# Altium schematic sheet 05-WPT.SchDoc: Wireless Power Transfer
size A2; DocumentNumber: 5; SheetNumber: 5; SheetTotal: 15
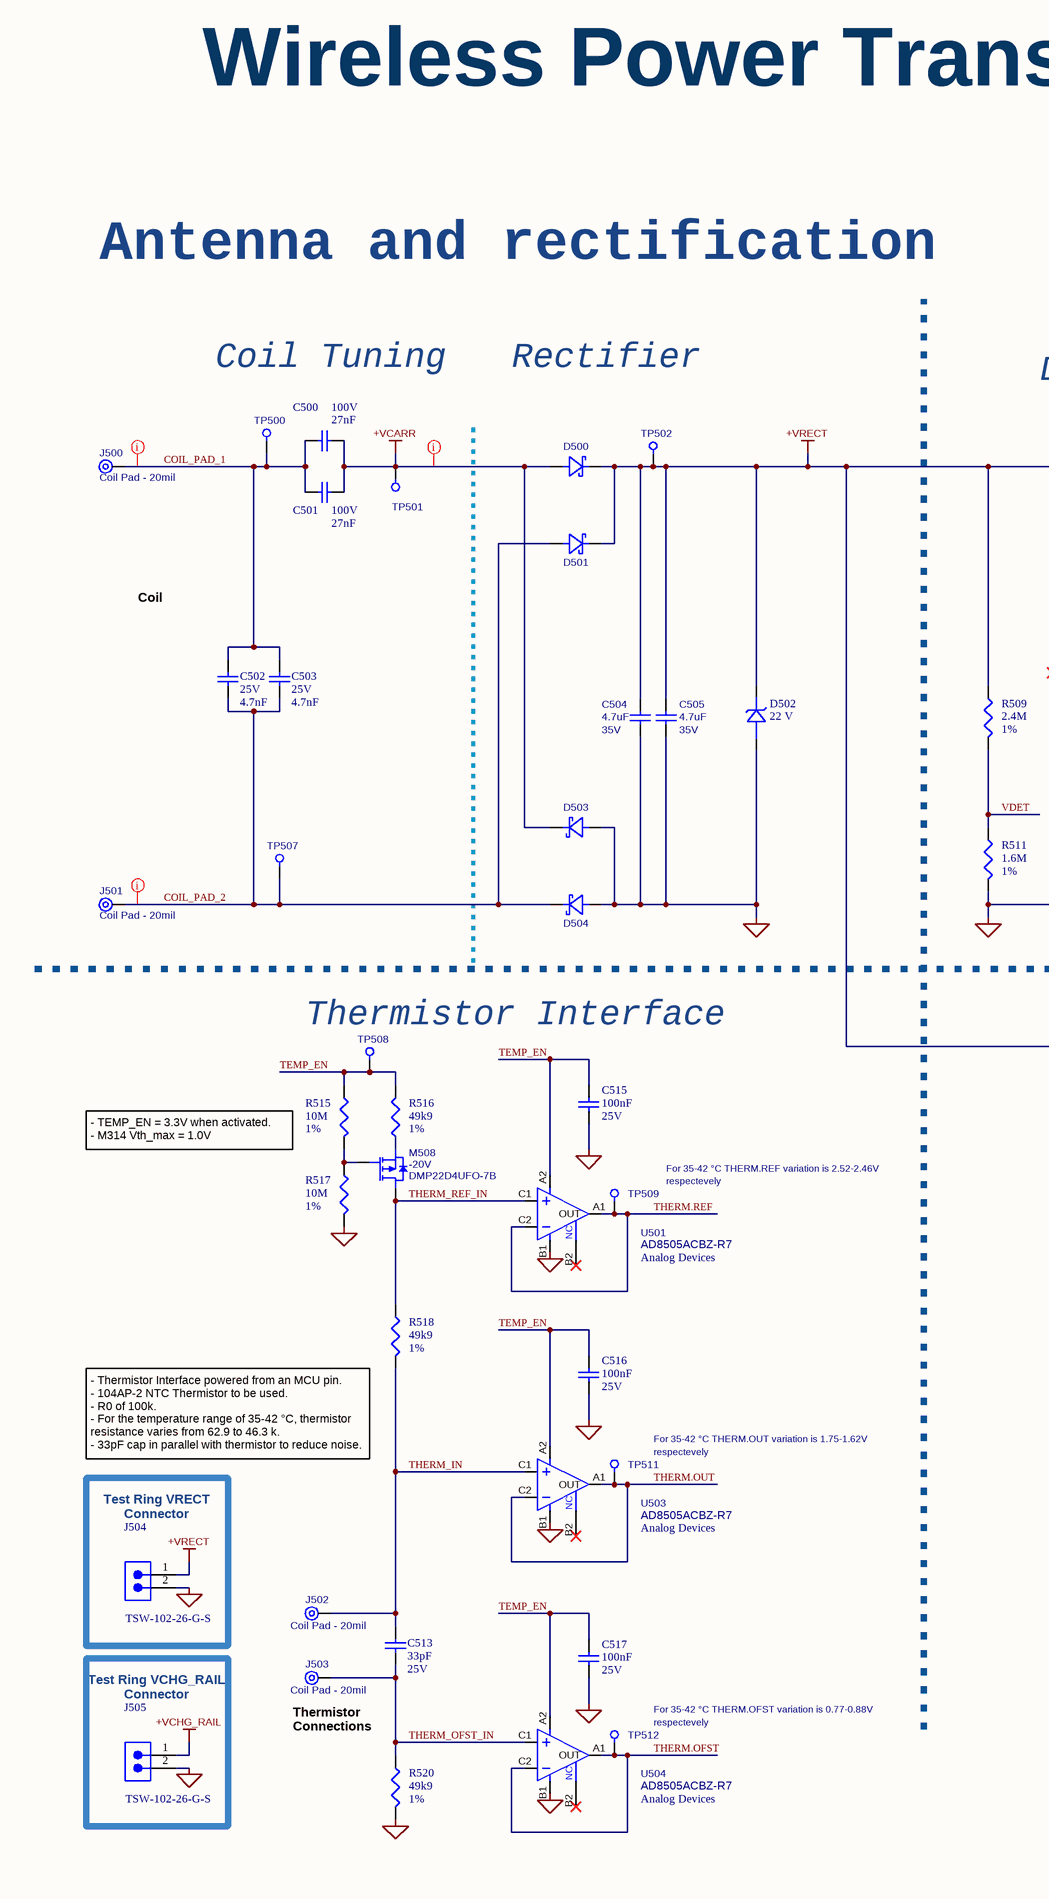
[diagram p0: 05-WPT.SchDoc, left]
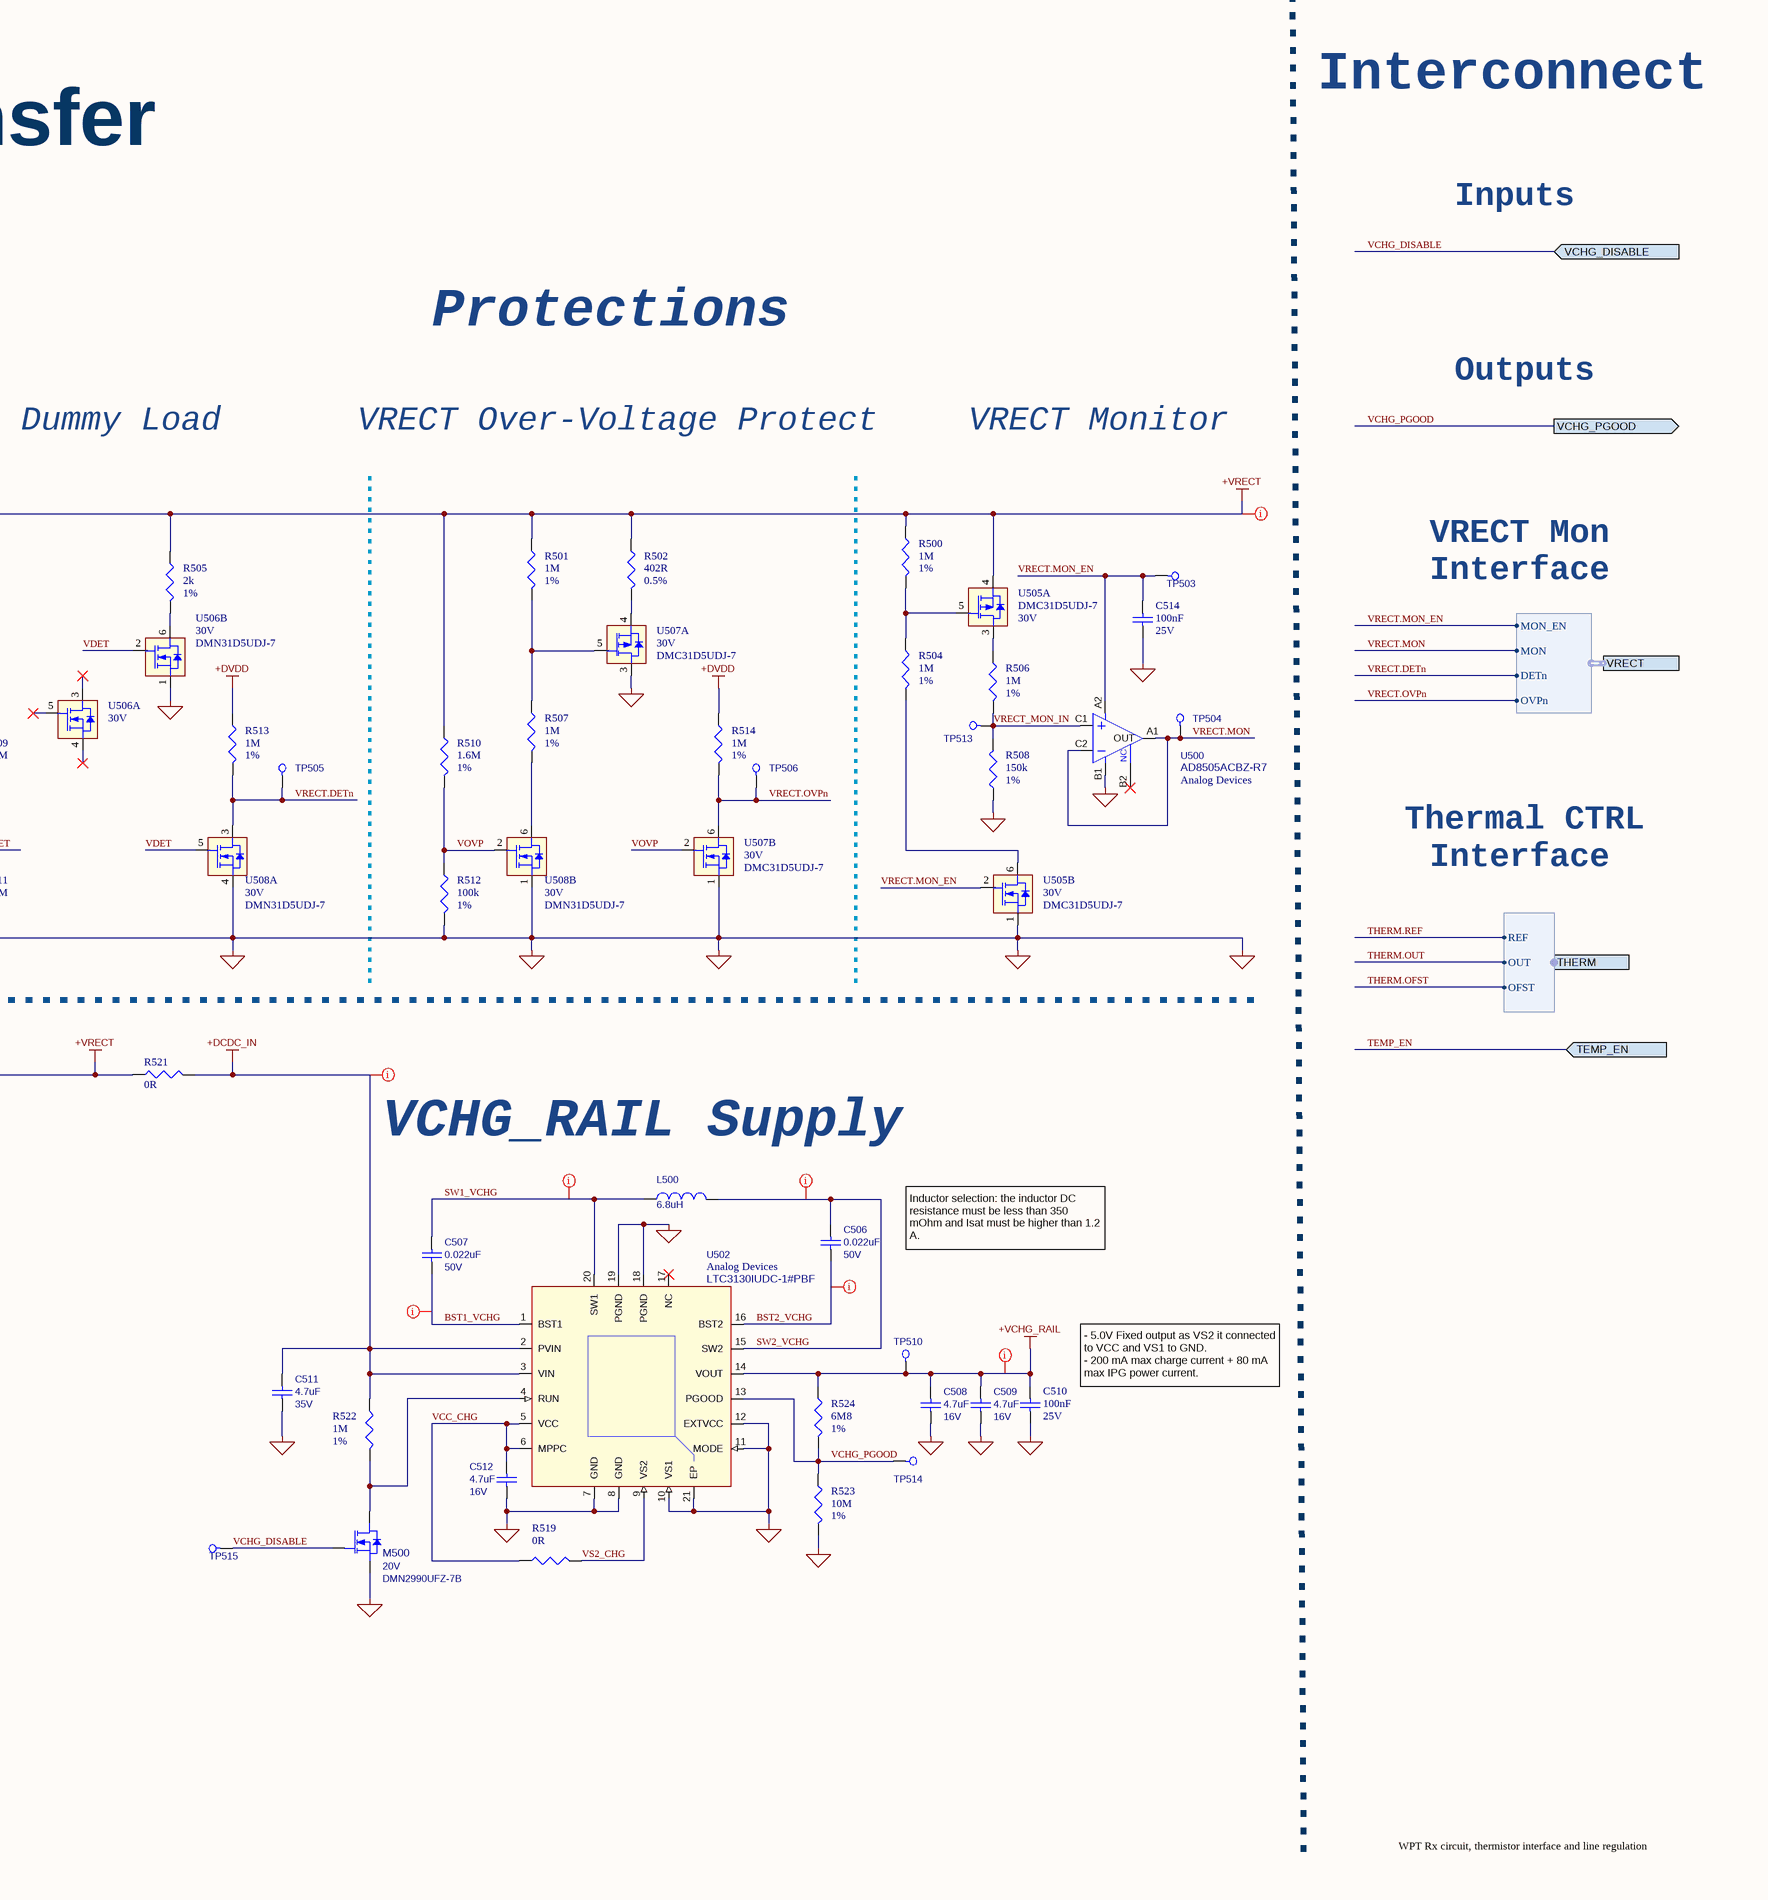
[diagram p1: 05-WPT.SchDoc, right]

## Parts
C500  value 27nF  Voltage Rating: 100V  [CAP0805_REDUCED]  (hidden comment: GRM2195C2A273GE01D)
C501  value 27nF  Voltage Rating: 100V  [CAP0805_REDUCED]  (hidden comment: GRM2195C2A273GE01D)
C502  value 4.7nF  Voltage Rating: 25V  [CAP0603_REDUCED]  (hidden comment: C0603C472F3GECTU)
C503  value 4.7nF  Voltage Rating: 25V  [CAP0603_REDUCED]  (hidden comment: C0603C472F3GECTU)
C504  value 4.7uF  Rating: 35V  [CAP0805_REDUCED]  (hidden comment: GCM21BC7YA475KE36L)
C505  value 4.7uF  Rating: 35V  [CAP0805_REDUCED]  (hidden comment: GCM21BC7YA475KE36L)
C506  value 0.022uF  Rating: 50V  [CAP0402_REDUCED]  (hidden comment: GCM155R71H223KA55D)
C507  value 0.022uF  Rating: 50V  [CAP0402_REDUCED]  (hidden comment: GCM155R71H223KA55D)
C508  value 4.7uF  Rating: 16V  [CAP0603_REDUCED]  (hidden comment: GRM188R61C475KE11)
C509  value 4.7uF  Rating: 16V  [CAP0603_REDUCED]  (hidden comment: GRM188R61C475KE11)
C510  value 100nF  Rated DC Voltage (URdc): 25V  [C0201_C]  (hidden comment: GRM033R61E104KE14J)
C511  value 4.7uF  Rating: 35V  [CAP0805_REDUCED]  (hidden comment: GCM21BC7YA475KE36L)
C512  value 4.7uF  Rating: 16V  [CAP0603_REDUCED]  (hidden comment: GRM188R61C475KE11)
C513  value 33pF  Rated DC Voltage (URdc): 25V  [C0201_C]  (hidden comment: GRM0335C1E330JA01D)
C514  value 100nF  Rated DC Voltage (URdc): 25V  [C0201_C]  (hidden comment: GRM033R61E104KE14J)
C515  value 100nF  Rated DC Voltage (URdc): 25V  [C0201_C]  (hidden comment: GRM033R61E104KE14J)
C516  value 100nF  Rated DC Voltage (URdc): 25V  [C0201_C]  (hidden comment: GRM033R61E104KE14J)
C517  value 100nF  Rated DC Voltage (URdc): 25V  [C0201_C]  (hidden comment: GRM033R61E104KE14J)
D500  GSBT0540X  [STM_SOD-523_R]  (value not drawn)
D501  GSBT0540X  [STM_SOD-523_R]  (value not drawn)
D502  Breakdown Voltage: 22 V  [SODFL1608X70N]  (hidden comment: MM5Z22VT5G)
D503  GSBT0540X  [STM_SOD-523_R]  (value not drawn)
D504  GSBT0540X  [STM_SOD-523_R]  (value not drawn)
J500  Coil Pad - 20mil  [FEEDHOLE_20mil]  (no BOM)
J501  Coil Pad - 20mil  [FEEDHOLE_20mil]  (no BOM)
J502  Coil Pad - 20mil  [FEEDHOLE_20mil]  (no BOM)
J503  Coil Pad - 20mil  [FEEDHOLE_20mil]  (no BOM)
J504  TSW-102-26-G-S  [SMTC-TSW-102-26-XX-S]
J505  TSW-102-26-G-S  [SMTC-TSW-102-26-XX-S]
L500  value 6.8uH  [LSEUC2520KKT6R8M]  (hidden comment: LSEUC2520KKT6R8M)
M500  DMN2990UFZ-7B  Rating: 20V  [DIODESINC_X2-DFN0606-3]
M508  Rating: -20V  [DIODESINC_X2-DFN0604-3]  (hidden comment: DMP22D4UFO-7B)
R500  value 1M  Tolerance: 1%  [R0201_C]  (hidden comment: CRCW02011M00FNED)
R501  value 1M  Tolerance: 1%  [R0201_C]  (hidden comment: CRCW02011M00FNED)
R502  value 402R  Tolerance: 0.5%  [R0603]  (hidden comment: SDR03EZPD4020)
R504  value 1M  Tolerance: 1%  [R0201_C]  (hidden comment: CRCW02011M00FNED)
R505  value 2k  Tolerance: 1%  [R0201_C]  (hidden comment: CRCW02012K00FNED)
R506  value 1M  Tolerance: 1%  [R0201_C]  (hidden comment: CRCW02011M00FNED)
R507  value 1M  Tolerance: 1%  [R0201_C]  (hidden comment: CRCW02011M00FNED)
R508  value 150k  Tolerance: 1%  [R0201_C]  (hidden comment: CRCW0201150KFKED)
R509  value 2.4M  Tolerance: 1%  [R0201_C]  (hidden comment: CRCW02012M40FNED)
R510  value 1.6M  Tolerance: 1%  [R0201_C]  (hidden comment: CRCW02011M60FNED)
R511  value 1.6M  Tolerance: 1%  [R0201_C]  (hidden comment: CRCW02011M60FNED)
R512  value 100k  Tolerance: 1%  [R0201_C]  (hidden comment: CRCW0201100KFNED)
R513  value 1M  Tolerance: 1%  [R0201_C]  (hidden comment: CRCW02011M00FNED)
R514  value 1M  Tolerance: 1%  [R0201_C]  (hidden comment: CRCW02011M00FNED)
R515  value 10M  Tolerance: 1%  [R0201_C]  (hidden comment: CRCW020110M0FNED)
R516  value 49k9  Tolerance: 1%  [R0201_C]  (hidden comment: CRCW020149K9FNED)
R517  value 10M  Tolerance: 1%  [R0201_C]  (hidden comment: CRCW020110M0FNED)
R518  value 49k9  Tolerance: 1%  [R0201_C]  (hidden comment: CRCW020149K9FNED)
R519  value 0R  [R0201_C]  (hidden comment: CRCW02010000Z0ED)
R520  value 49k9  Tolerance: 1%  [R0201_C]  (hidden comment: CRCW020149K9FNED)
R521  value 0R  [R0201_C]  (hidden comment: CRCW02010000Z0ED)
R522  value 1M  Tolerance: 1%  [R0201_C]  (hidden comment: CRCW02011M00FNED)
R523  value 10M  Tolerance: 1%  [R0201_C]  (hidden comment: CRCW020110M0FNED)
R524  value 6M8  Tolerance: 1%  [R0201_C]  (hidden comment: CRCW02016M80FNED)
TP500  Test Point  [testpad_0.9mm]  (value not drawn)  (no BOM)
TP501  Test Point  [testpad_0.9mm]  (value not drawn)  (no BOM)
TP502  Test Point  [testpad_0.9mm]  (value not drawn)  (no BOM)
TP503  Test Point  [testpad_0.9mm]  (value not drawn)  (no BOM)
TP504  Test Point  [testpad_0.9mm]  (value not drawn)  (no BOM)
TP505  Test Point  [testpad_0.9mm]  (value not drawn)  (no BOM)
TP506  Test Point  [testpad_0.9mm]  (value not drawn)  (no BOM)
TP507  Test Point  [testpad_0.9mm]  (value not drawn)  (no BOM)
TP508  Test Point  [testpad_0.9mm]  (value not drawn)  (no BOM)
TP509  Test Point  [testpad_0.9mm]  (value not drawn)  (no BOM)
TP510  Test Point  [testpad_0.9mm]  (value not drawn)  (no BOM)
TP511  Test Point  [testpad_0.9mm]  (value not drawn)  (no BOM)
TP512  Test Point  [testpad_0.9mm]  (value not drawn)  (no BOM)
TP513  Test Point  [testpad_0.9mm]  (value not drawn)  (no BOM)
TP514  Test Point  [testpad_0.9mm]  (value not drawn)  (no BOM)
TP515  Test Point  [testpad_0.9mm]  (value not drawn)  (no BOM)
U500  Manufacturer: Analog Devices  [AD8505ACBZ-R7]  (hidden comment: AD8505ACBZ-R7)
U501  Manufacturer: Analog Devices  [AD8505ACBZ-R7]  (hidden comment: AD8505ACBZ-R7)
U502  Manufacturer: Analog Devices  [LT_UDC-20_REDUCED]  (hidden comment: LTC3130IUDC-1#PBF)
U503  Manufacturer: Analog Devices  [AD8505ACBZ-R7]  (hidden comment: AD8505ACBZ-R7)
U504  Manufacturer: Analog Devices  [AD8505ACBZ-R7]  (hidden comment: AD8505ACBZ-R7)
U505  DMC31D5UDJ-7  Vds(Max): 30V  [DIODESINC_SOT-963-6]  (parts A,B of 2)
U506  Vds(Max): 30V  [DIODESINC_SOT-963-6]  (hidden comment: DMN31D5UDJ-7)  (parts A,B of 2)
U507  DMC31D5UDJ-7  Vds(Max): 30V  [DIODESINC_SOT-963-6]  (parts A,B of 2)
U508  DMN31D5UDJ-7  Vds(Max): 30V  [DIODESINC_SOT-963-6]  (parts A,B of 2)

## Ports
TEMP_EN (in), THERM (harness THERMAL CTRL), VCHG_DISABLE (in), VCHG_PGOOD (out), VRECT (harness VRECT)

## Harnesses
THERMAL CTRL: REF, OUT, OFST
VRECT: OVPn, DETn, MON, MON_EN

## Nets
+DCDC_IN: C511.2 R521.2 R522.1 U502.2(PVIN) U502.3(VIN)
+DVDD: R513.1 R514.1
+VCARR: C500.2 C501.2 D500.2 D503.1 TP501.1
+VCHG_RAIL: C508.1 C509.1 C510.2 J505.1 R524.1 TP510.1 U502.14(VOUT)
+VRECT: C504.2 C505.2 D500.1 D501.1 D502.1(K1) J504.1 R500.1 R501.1 R502.1 R505.1 R509.1 R510.1 R521.1 TP502.1 U505.4
GND: C504.1 C505.1 C508.2 C509.2 C510.1 C511.1 C512.2 C514.1 C515.1 C516.1 C517.1 D502.2(K1) D503.2 D504.2 J504.2 J505.2 M500.2(S) R508.1 R511.2 R512.2 R517.2 R520.2 R523.2 U500.B1(V-) U501.B1(V-) U502.7(GND) U502.8(GND) U502.10(VS1) U502.11(MODE) U502.12(EXTVCC) U502.18(PGND) U502.19(PGND) U502.21(EP) U503.B1(V-) U504.B1(V-) U505.1 U506.1 U507.1 U507.3 U508.1 U508.4
BST1_VCHG: C507.1 U502.1(BST1)
BST2_VCHG: C506.1 U502.16(BST2)
COIL_PAD_1: C500.1 C501.1 C502.2 C503.2 J500.1 TP500.1
COIL_PAD_2: C502.1 C503.1 D501.2 D504.1 J501.1 TP507.1
SW1_VCHG: C507.2 L500.1 U502.20(SW1)
SW2_VCHG: C506.2 L500.2 U502.15(SW2)
TEMP_EN: C515.2 C516.2 C517.2 R515.1 R516.2 TP508.1 U501.A2(V+) U503.A2(V+) U504.A2(V+) ; port TEMP_EN
THERM.OFST: TP512.1 U504.A1(OUT) U504.C2(IN-) ; port THERM.OFST
THERM.OUT: TP511.1 U503.A1(OUT) U503.C2(IN-) ; port THERM.OUT
THERM.REF: TP509.1 U501.A1(OUT) U501.C2(IN-) ; port THERM.REF
THERM_IN: C513.2 J502.1 R518.2 U503.C1(IN+)
THERM_OFST_IN: C513.1 J503.1 R520.1 U504.C1(IN+)
THERM_REF_IN: M508.3(D) R518.1 U501.C1(IN+)
VCC_CHG: C512.1 R519.1 U502.5(VCC) U502.6(MPPC)
VCHG_DISABLE: M500.1(G) TP515.1 ; port VCHG_DISABLE
VCHG_PGOOD: R523.1 R524.2 TP514.1 U502.13(PGOOD) ; port VCHG_PGOOD
VDET: R509.2 R511.1 U506.2 U508.5
VOVP: R510.2 R512.1 U507.2 U508.2
VRECT.DETn: R513.2 TP505.1 U508.3 ; port VRECT.DETn
VRECT.MON: TP504.1 U500.A1(OUT) U500.C2(IN-) ; port VRECT.MON
VRECT.MON_EN: C514.2 TP503.1 U500.A2(V+) U505.2 ; port VRECT.MON_EN
VRECT.OVPn: R514.2 TP506.1 U507.6 ; port VRECT.OVPn
VRECT_MON_IN: R506.2 R508.2 TP513.1 U500.C1(IN+)
VS2_CHG: R519.2 U502.9(VS2)
NetM500_3: M500.3(D) R522.2 U502.4(RUN)
NetM508_1: M508.1(G) R515.2 R517.1
NetM508_2: M508.2(S) R516.1
NetR500_2: R500.2 R504.1 U505.5
NetR501_2: R501.2 R507.1 U507.5
NetR502_2: R502.2 U507.4
NetR504_2: R504.2 U505.6
NetR505_2: R505.2 U506.6
NetR506_1: R506.1 U505.3
NetR507_2: R507.2 U508.6

Not connected (* = marked no-connect by the designer): U500 B2(NC)*; U501 B2(NC)*; U502 17(NC)*; U503 B2(NC)*; U504 B2(NC)*; U506 3* 4* 5*

## Layout directives
rule Supply Nets [Voltage = 5.000]; net class POWER: +VCHG_RAIL
net class POWER; Voltage: 0-11V: +DCDC_IN, +VCARR, +VRECT, COIL_PAD_1, COIL_PAD_2
net class POWER; Voltage: 0-11V; net class DCDC_LOOP: BST1_VCHG, BST2_VCHG, SW1_VCHG, SW2_VCHG

## Notes on the sheet
- Interconnect
- Wireless Power Transfer
- Inputs
- Antenna and rectification
- Protections
- Coil Tuning
- Rectifier
- Outputs
- Dummy Load
- VRECT Over-Voltage Protect
- VRECT Monitor
- VRECT Mon
- Interface
- Coil
  Connections
- Thermal CTRL
- (near TP508) Thermistor Interface
- - TEMP_EN = 3.3V when activated.
  - M314 Vth_max = 1.0V
- VCHG_RAIL Supply
- For 35-42 °C THERM.REF variation is 2.52-2.46V
- respectevely
- Inductor selection: the inductor DC resistance must be less than 350 mOhm and Isat must be higher than 1.2 A.
- - 5.0V Fixed output as VS2 it connected to VCC and VS1 to GND.
  - 200 mA max charge current + 80 mA max IPG power current.
- (near R518) - Thermistor Interface powered from an MCU pin.
  - 104AP-2 NTC Thermistor to be used.
  - R0 of 100k.
  - For the temperature range of 35-42 °C, thermistor resistance varies from 62.9 to 46.3 k.
  - 33pF cap in parallel with thermistor to reduce noise.
- For 35-42 °C THERM.OUT variation is 1.75-1.62V
- (near J504) Test Ring VRECT
  Connector
- (near J505) Test Ring VCHG_RAIL
  Connector
- For 35-42 °C THERM.OFST variation is 0.77-0.88V
- Thermistor
  Connections
- WPT Rx circuit, thermistor interface and line regulation
- Project:
- Schematic:
- Design by:
- Date:
- Ver:
- .
- Comments:
- Reviewed by:

## Library data of the parts
C500 C501 = GRM2195C2A273GE01D: Capacitor, 27nF, C0G, 100VDC, 2%, 0805, Implant-grade; Manufacturer: Murata; Medical Grade Manufacturer: TBD; Category: Capacitor; Temperature Coefficient: -; Manufacturer Part Number: GRM2195C2A273GE01D; Medical Grade Manufacturer Part Number: TBD; Size Code: Size Code; Supplier: TBD; Supplier Part Number: 0.85mm; Height: 1.25mm; Width: 1.25mm; Length: 2mm; Tolerance: 2%; Dielectric: C0G; Supplier 1: Mouser; Supplier Part Number 1: 81-GRM2195C2A273GE1D; Supplier 2: Digikey; Supplier Part Number 2: 490-GRM2195C2A273GE01DCT-ND; Supplier 3: Digikey; Supplier Part Number 3: 490-GRM2195C2A273GE01DDKR-ND; Supplier 4: Digikey; Supplier Part Number 4: 490-GRM2195C2A273GE01DTR-ND
C502 C503 = C0603C472F3GECTU: Capacitor, 4.7nF, C0G, 25V, 1%, 0603, Implant-grade; Manufacturer: KEMET; Medical Grade Manufacturer: TBD; Category: Capacitor; Temperature Coefficient: -; Manufacturer Part Number: C0603C472F3GECTU; Medical Grade Manufacturer Part Number: TBD; Size Code: 0805; Supplier: -; Supplier Part Number: -; Height: 0.78mm; Width: 1.25mm; Length: 2mm; Tolerance: 1%; Dielectric: C0G; Supplier 1: Mouser; Supplier Part Number 1: 80-C0603C472F3GEC
C504 C505 C511 = GCM21BC7YA475KE36L: Capacitor, 4.7uF, X7S, 35V, 10%, 0805, Implant-grade; Manufacturer: Murata; Medical Grade MFR PN: GCH21BC7YA475KE11; Review: 020823; Length (mm): 2.00 ±0.20; Medical Grade MFR: Murata; PCB Footprint: cap0805_reduced; Thickness (mm): 1.25 ±0.20; Width (mm): 1.25 ±0.20; Category: Capacitor; Package Description: 0805; Check: *; Supplier 1: Arrow Electronics; Supplier Part Number 1: GCM21BC7YA475KE36L; Status: Approved; Manufacturer Part Number: GCM21BC7YA475KE36L
C506 C507 = GCM155R71H223KA55D: Capacitor, 0.022uF, X7R, 50V, 10%, 0402, Implant-grade; Manufacturer: Murata; Medical Grade MFR PN: GCH155R71H223KE01; Review: 020823; Length (mm): 1.00 ±0.05; Medical Grade MFR: Murata; PCB Footprint: cap0402_reduced; Thickness (mm): 0.50 ±0.05; Width (mm): 0.50 ±0.05; Category: Capacitor; Package Description: 0402; Check: *; Supplier 1: Arrow Electronics; Supplier Part Number 1: GCM155R71H223KA55D; Status: Approved; Manufacturer Part Number: GCM155R71H223KA55D
C508 C509 C512 = GRM188R61C475KE11: Capacitor, 4.7uF, X5R, 16V, 10%, 0603, Implant-grade; Manufacturer: Murata; Medical Grade MFR PN: GCH188R61C475KE11; Length (mm): 1.60 ±0.10; Medical Grade MFR: Murata; PCB Footprint: cap0603_reduced; Thickness (mm): 0.80 ±0.10; Width (mm): 0.80 ±0.10; Category: Capacitor; Package Description: 0603; Check: *; Supplier 1: Arrow Electronics; Supplier Part Number 1: GRM188R61C475KE11D; Status: *; Review: *; Manufacturer Part Number: GRM188R61C475KE11
C510 C514-C517 = GRM033R61E104KE14J: Ceramic Capacitor, Multilayer, Ceramic, 25V, 10% +Tol, 10% -Tol, X5R, 15% TC, 0.1uF, Surface Mount, 0201; Manufacturer: Murata; Multilayer: Yes; Supplier: Digikey; Supplier Part Number: 490-14571-1-ND; Manufacturer Part Number: GRM033R61E104KE14J; RoHS: Yes; Category: Ceramic Capacitors; Stock: 1540851; Pricing: 1=0,1, 10=0,033, 50=0,0192, 100=0,0148, 500=0,01118, 1000=0,00878, 2500=0,00798, 5000=0,00734 (USD); Mounting Technology: Surface Mount; Pins: 2; Dielectric Material: Ceramic; Package Shape: Rectangular; Case/Package: 0201; Terminal Finish: Nickel; Min Operating Temperature: -55°C; Max Operating Temperature: 85°C; JESD-609 Code: e3; Capacitor Type: Ceramic; Tolerance  (fill in as +-): 10%; Package Style: SMTMeter; Packaging: Tape and Reel; Tolerance (fill in as +-): 10%; Temperature Characteristics Code: X5R; Termination: Wraparound; Length: 0.6mm; Width: 0.3mm; Height: 0.3mm; Reach SVHC Compliant: Yes; RoHS Compliant: Yes; ComponentLink1URL: https://psearch.en.murata.com:443/capacitor/product/GRM033R61E104KE14%23.pdf?src-supplier=IHS+Markit; ComponentLink1Description: https://psearch.en.murata.com:443/capacitor/product/GRM033R61E104KE14%23.pdf?src-supplier=IHS+Markit; ComponentLink2URL: http://www.mouser.com/ds/2/281/c02e-2905.pdf?src-supplier=Mouser; ComponentLink2Description: http://www.mouser.com/ds/2/281/c02e-2905.pdf?src-supplier=Mouser; ComponentLink3URL: http://search.murata.co.jp/Ceramy/image/img/A01X/G101/ENG/GRM033R61E104KE14-01.pdf?src-supplier=Digikey; ComponentLink3Description: http://search.murata.co.jp/Ceramy/image/img/A01X/G101/ENG/GRM033R61E104KE14-01.pdf?src-supplier=Digikey; ComponentLink4URL: https://search.murata.co.jp/Ceramy/image/img/A01X/G101/ENG/GRM033R61E104KE14-01.pdf?src-supplier=Digikey; ComponentLink4Description: https://search.murata.co.jp/Ceramy/image/img/A01X/G101/ENG/GRM033R61E104KE14-01.pdf?src-supplier=Digikey; Supplier 1: Arrow Electronics; Supplier Part Number 1: GRM033R61E104KE14J
C513 = GRM0335C1E330JA01D: Ceramic Capacitor, Multilayer, Ceramic, 25V, 5% +Tol, 5% -Tol, C0G, 30ppm/Cel TC, 0.000033uF, Surface Mount, 0201; Manufacturer: Murata; Multilayer: Yes; Supplier: Digikey; Supplier Part Number: 490-10678-1-ND; Manufacturer Part Number: GRM0335C1E330JA01D; RoHS: Yes; Category: Ceramic Capacitors; Stock: 355128; Pricing: 1=0,1, 10=0,011, 50=0,0062, 100=0,0048, 500=0,0036, 1000=0,00283, 2500=0,00258, 5000=0,00237 (USD); Mounting Technology: Surface Mount; Pins: 2; Dielectric Material: Ceramic; Package Shape: Rectangular; Case/Package: 0201; Terminal Finish: Nickel; Min Operating Temperature: -55°C; Max Operating Temperature: 125°C; JESD-609 Code: e3; Capacitor Type: Ceramic; Tolerance  (fill in as +-): 5%; Package Style: SMTMeter; Packaging: Tape and Reel; Tolerance (fill in as +-): 5%; Temperature Characteristics Code: C0G; Termination: Wraparound; Length: 0.6mm; Width: 0.3mm; Height: 0.3mm; Reach SVHC Compliant: Yes; RoHS Compliant: Yes; ComponentLink1URL: https://datasheet.ciiva.com:443/pdfs/VipMasterIC/IC/MURE/MURE-S-A0004347008/MURE-S-A0004347461-1.pdf?src-supplier=IHS+Markit; ComponentLink1Description: https://datasheet.ciiva.com:443/pdfs/VipMasterIC/IC/MURE/MURE-S-A0004347008/MURE-S-A0004347461-1.pdf?src-supplier=IHS+Markit; ComponentLink2URL: https://datasheet.ciiva.com/29538/partnumbering-e-01-29538933.pdf?src-supplier=Digikey; ComponentLink2Description: https://datasheet.ciiva.com/29538/partnumbering-e-01-29538933.pdf?src-supplier=Digikey; Supplier 1: Arrow Electronics; Supplier Part Number 1: GRM0335C1E330JA01D
D500 D501 D503 D504 = GSBT0540X: DIODE SCHOTTKY 40V 500MA SOD523; Manufacturer: Good-Ark Semiconductor; Medical Grade MFR: TBD; Rating: 40V, 500mA; Medical Grade MFR PN: TBD; PCB Footprint: TBD; Category: Diode; Package Description: SOD-523; Supplier 1: Digikey; Supplier Part Number 1: 4786-GSBT0540XCT-ND; Manufacturer Part Number: GSBT0540X
D502 = MM5Z22VT5G: ZEN SOD523 LOW IZ REG 0.5W 22V; Manufacturer: onsemi; Type: Zener; Number of Channels: 1; Forward Voltage: 900 mV @ 10 mA; Power Dissipation: 500 mW; Category: Diode; Manufacturer Part Number: MM5Z22VT5G; Supplier 1: Digikey; Supplier Part Number 1: MM5Z2V4T1GOSCT-ND; Mounting Type: SMD; Height: 0.6 mm; Working Voltage: *; Clamping Voltage: *; Peak Pulse Current: *; Diode Capacitance: *
J500-J503 = Coil Pad - 20mil: Coil TH pad, 20mil; PCB Footprint: TBD; Value: Coil Solder Pad; Category: Coil Solder Pad; Length (mm): TBD; Manufacturer: N/A; Manufacturer PN: N/A; Medical Grade MFR: N/A; Medical Grade MFR PN: N/A; Rating: N/A; Thickness (mm): N/A; Width (mm): TBD; Package Description: N/A; Status: *; Review: *
J504 J505 = TSW-102-26-G-S: Conn Unshrouded Header HDR 2 POS 2.54mm Solder ST Thru-Hole; Manufacturer: Samtec; Number of Contacts: 2; Gender: Male; Max Current Rating: 7.6A; Max Voltage Rating (AC): 550V; RoHS: True; ComponentLink1Description: Manufacturer URL; DatasheetVersion: F-214; Orientation: Vertical; Pitch: 2.54 mm; ComponentLink1URL: http://www.samtec.com; ComponentLink3Description: Package Specification; ComponentLink2Description: Datasheet; PackageVersion: DM, 8/1988; PackageDescription: .025[0.64] SQ. Post Terminal Strip Assembly; PackageReference: TSW-102-26-XX-S; Mounting Technology: Through-hole; Temperature Range: -55 to 125 degC; ComponentLink3URL: http://www.samtec.com/documents/webfiles/cpdf/TSW-XXX-XX-XXX-X-XX-XXX-MKT.pdf; ComponentLink2URL: http://www.samtec.com/documents/webfiles/pdf/TSW_TH.PDF; PartNumber: TSW-102-26-G-S; Supplier: Newark; Supplier Part Number: 12P1301; Manufacturer Part Number: TSW-102-26-G-S; Category: Connectors; Stock: 3117; Pricing: 1=0.51000, 10=0.47500, 100=0.33200, 500=0.28400, 1000=0.23700, 2500=0.21000, 5000=0.20400 (USD); Contact Material: Bronze; Contact Finish - Mating: GOLD; Insulation Color: Black; Insulation Material: PBT; Connector Type: Header; Termination: Solder; Flammability Rating: UL94 V-0; Reach SVHC Compliant: Yes; RoHS Compliant: Yes; ComponentLink4URL: https://datasheet.ciiva.com/10281/htsw-th-10281416.pdf?src-supplier=Avnet; ComponentLink4Description: https://datasheet.ciiva.com/10281/htsw-th-10281416.pdf?src-supplier=Avnet; ComponentLink5URL: https://datasheet.ciiva.com/6887/tsw-xxx-xx-xxx-x-xx-xxx-mkt-6887237.pdf?src-supplier=Digi-Key; ComponentLink5Description: https://datasheet.ciiva.com/6887/tsw-xxx-xx-xxx-x-xx-xxx-mkt-6887237.pdf?src-supplier=Digi-Key; Supplier 1: Digikey; Supplier Part Number 1: SAM1077-02-ND; Contact Plating: Gold; Color: Black; Housing Material: Polyester; Contact Shape: Square; Housing Color: Black; Min Operating Temperature: -55°C; Max Operating Temperature: 125°C; Number of Rows: 1; Packaging: Bulk; Number of Positions: 2; Series: TSW; Contact Type: Male Pin; Fastening Type: Pull; Package Quantity: 1; Length: 5.08mm; Width: 2.54mm; Contact Mating Length: 0.23inch; Depth: 2.54mm; Radiation Hardening: No; Lead Free: Lead Free
L500 = LSEUC2520KKT6R8M: 6.8 µH Unshielded Wirewound Inductor 1.3 A 265mOhm Max 1008 (2520 Metric); Manufacturer: Taiyo Yuden; Medical Grade MFR: TBD; Rating: 1.3A; Length (mm): 2.50 ±0.20; Medical Grade MFR PN: TBD; PCB Footprint: TBD; Thickness (mm): 1.00; Width (mm): 2.00 ±0.20; Category: Inductor; Supplier 1: DigiKey; Supplier Part Number 1: 587-LSEUC2520KKT6R8MCT-ND; Manufacturer Part Number: LSEUC2520KKT6R8M
M500 = DMN2990UFZ-7B: MOSFET, N-Chan, 20V, 170mA, DFN0606; Manufacturer: Diodes Inc; Medical Grade MFR: TBD; Review: 020823; Category: Transistor; Length (mm): 0.62 ±0.05; Medical Grade MFR PN: TBD; PCB Footprint: TBD; Thickness (mm): 0.38 ±0.02; Value: DMN2990UFZ-7B; Width (mm): 0.62 ±0.05; Supplier 1: Digi-Key; Supplier Part Number 1: DMN2990UFZ-7BDICT-ND; Status: Approved; Manufacturer Part Number: DMN2990UFZ-7B
M508 = DMP22D4UFO-7B: MOSFET, P-chan, -20V, -383mA, DFN0604; Manufacturer: Diodes Inc; Medical Grade MFR: TBD; Review: 020823; Category: Transistor; Length (mm): 0.60 ±0.05; Medical Grade MFR PN: TBD; PCB Footprint: TBD; Thickness (mm): 0.36 ±0.04; Value: DMP22D4UFO-7B; Width (mm): 0.40 ±0.05; Supplier 1: Digi-Key; Supplier Part Number 1: 31-DMP22D4UFO-7BCT-ND; Status: Approved; Manufacturer Part Number: DMP22D4UFO-7B
R500 R501 R504 R506 R507 R513 R514 R522 = CRCW02011M00FNED: Fixed Resistor, Metal Glaze/thick Film, 0.05W, 1000000ohm, 30V, 1% +/-Tol, 200ppm/Cel, Surface Mount, 0201; Manufacturer: Vishay; Medical Grade MFR: Mini-Systems; Medical Grade MFR PN: MWA96SM-1004F-NS62TR; Power: 50mW; Rated Temperature: 70°C; Temperature Coefficient: 200ppm/°C; Package Height: 0.23mm; Package Length: 0.6mm; Package Width: 0.3mm; Reference Standard: AEC-Q200; Category: Chip SMD Resistors; Supplier: Digikey; Supplier Part Number: 541-1.00MABCT-ND; Manufacturer Part Number: CRCW02011M00FNED; RoHS: Yes; Stock: 392914; Pricing: 1=0,1, 10=0,037, 50=0,0242, 100=0,0204, 500=0,01426, 1000=0,01241, 5000=0,00924 (USD); Mounting Technology: Surface Mount; Pins: 2; Package Shape: Rectangular; Case/Package: 0201; Terminal Finish: Nickel; Min Operating Temperature: -55°C; Max Operating Temperature: 155°C; JESD-609 Code: e3; Resistor Type: FIXED RESISTOR; Construction: Chip; Package Style: SMTMeter; Packaging: Tape and Reel; Technology: METAL GLAZE/THICK FILM; Termination: Wraparound; Working Voltage: 30V; Reach SVHC Compliant: Yes; RoHS Compliant: Yes; ComponentLink1URL: https://datasheet.ciiva.com:443/pdfs/VipMasterIC/IC/VISH/VISH-S-A0002932828/VISH-S-A0002932828-1.pdf?src-supplier=IHS+Markit; ComponentLink1Description: https://datasheet.ciiva.com:443/pdfs/VipMasterIC/IC/VISH/VISH-S-A0002932828/VISH-S-A0002932828-1.pdf?src-supplier=IHS+Markit; ComponentLink2URL: https://datasheet.ciiva.com/7841/1719906-7841438.pdf?src-supplier=Element14; ComponentLink2Description: https://datasheet.ciiva.com/7841/1719906-7841438.pdf?src-supplier=Element14; ComponentLink3URL: https://datasheet.ciiva.com/7841/1719906-7841439.pdf?src-supplier=Element14; ComponentLink3Description: https://datasheet.ciiva.com/7841/1719906-7841439.pdf?src-supplier=Element14; ComponentLink4URL: https://datasheet.ciiva.com/7859/dcrcwe3-7859689.pdf?src-supplier=Element14; ComponentLink4Description: https://datasheet.ciiva.com/7859/dcrcwe3-7859689.pdf?src-supplier=Element14; ComponentLink5URL: https://datasheet.ciiva.com/16757/70202042-16757675.pdf?src-supplier=Allied+Electronics; ComponentLink5Description: https://datasheet.ciiva.com/16757/70202042-16757675.pdf?src-supplier=Allied+Electronics; ComponentLink6URL: https://datasheet.ciiva.com/22692/1719906-22692761.pdf?src-supplier=Element14; ComponentLink6Description: https://datasheet.ciiva.com/22692/1719906-22692761.pdf?src-supplier=Element14; ComponentLink7URL: https://datasheet.ciiva.com/9109/crcw0201e3-9109910.pdf?src-supplier=Avnet; ComponentLink7Description: https://datasheet.ciiva.com/9109/crcw0201e3-9109910.pdf?src-supplier=Avnet; ComponentLink8URL: https://datasheet.ciiva.com/22675/1847332-22675065.pdf?src-supplier=Element14; ComponentLink8Description: https://datasheet.ciiva.com/22675/1847332-22675065.pdf?src-supplier=Element14; ComponentLink9URL: https://datasheet.ciiva.com/2474/crcw0201e3-2474824.pdf?src-supplier=Digikey; ComponentLink9Description: https://datasheet.ciiva.com/2474/crcw0201e3-2474824.pdf?src-supplier=Digikey; ComponentLink10URL: https://datasheet.ciiva.com/2474/crcw0201e3-2474825.pdf?src-supplier=Digikey; ComponentLink10Description: https://datasheet.ciiva.com/2474/crcw0201e3-2474825.pdf?src-supplier=Digikey; ComponentLink11URL: https://datasheet.ciiva.com/2474/crcw0201e3-2474826.pdf?src-supplier=Digikey; ComponentLink11Description: https://datasheet.ciiva.com/2474/crcw0201e3-2474826.pdf?src-supplier=Digikey; Supplier 1: Digikey; Supplier Part Number 1: 541-1.00MABCT-ND
R502 = SDR03EZPD4020: 402 Ohms ±0.5% 0.4W Chip Resistor 0603 (1608 Metric) Automotive AEC-Q200, Pulse Withstanding Thick Film; Manufacturer: Vishay; Power: 400mW; Category: Chip SMD Resistors; Manufacturer Part Number: SDR03EZPD4020; RoHS: Yes; Mounting Technology: Surface Mount; Pins: 2; Package Shape: Rectangular; Case/Package: 0603; Terminal Finish: Nickel; Min Operating Temperature: -55°C; Max Operating Temperature: 155°C; Construction: Chip; ComponentLink1URL: https://datasheet.ciiva.com:443/pdfs/VipMasterIC/IC/VISH/VISH-S-A0002932828/VISH-S-A0002932828-1.pdf?src-supplier=IHS+Markit; ComponentLink1Description: https://datasheet.ciiva.com:443/pdfs/VipMasterIC/IC/VISH/VISH-S-A0002932828/VISH-S-A0002932828-1.pdf?src-supplier=IHS+Markit; ComponentLink2URL: https://datasheet.ciiva.com/2471/crcw0201e3-2471712.pdf?src-supplier=Digikey; ComponentLink2Description: https://datasheet.ciiva.com/2471/crcw0201e3-2471712.pdf?src-supplier=Digikey; ComponentLink3URL: https://datasheet.ciiva.com/7841/1719906-7841431.pdf?src-supplier=Element14; ComponentLink3Description: https://datasheet.ciiva.com/7841/1719906-7841431.pdf?src-supplier=Element14; ComponentLink4URL: https://datasheet.ciiva.com/7841/1719906-7841430.pdf?src-supplier=Element14; ComponentLink4Description: https://datasheet.ciiva.com/7841/1719906-7841430.pdf?src-supplier=Element14; ComponentLink5URL: https://datasheet.ciiva.com/22665/1847332-22665688.pdf?src-supplier=Element14; ComponentLink5Description: https://datasheet.ciiva.com/22665/1847332-22665688.pdf?src-supplier=Element14; ComponentLink6URL: https://datasheet.ciiva.com/2471/crcw0201e3-2471713.pdf?src-supplier=Digikey; ComponentLink6Description: https://datasheet.ciiva.com/2471/crcw0201e3-2471713.pdf?src-supplier=Digikey; Supplier 1: DigiKey; Supplier Part Number 1: 846-SDR03EZPD4020CT-ND; ComponentLink7URL: https://datasheet.ciiva.com/2471/crcw0201e3-2471711.pdf?src-supplier=Digikey; ComponentLink7Description: https://datasheet.ciiva.com/2471/crcw0201e3-2471711.pdf?src-supplier=Digikey; ComponentLink8URL: https://datasheet.ciiva.com/16757/70202042-16757849.pdf?src-supplier=Allied+Electronics; ComponentLink8Description: https://datasheet.ciiva.com/16757/70202042-16757849.pdf?src-supplier=Allied+Electronics; ComponentLink9URL: https://datasheet.ciiva.com/16436/crcw0201e3-16436237.pdf?src-supplier=Future+Electronics; ComponentLink9Description: https://datasheet.ciiva.com/16436/crcw0201e3-16436237.pdf?src-supplier=Future+Electronics
R505 = CRCW02012K00FNED: Fixed Resistor, Metal Glaze/thick Film, 0.05W, 2000ohm, 30V, 1% +/-Tol, 200ppm/Cel, Surface Mount, 0201; Manufacturer: Vishay Dale; Medical Grade MFR: Mini-Systems; Medical Grade MFR PN: MWA96SM-4021F-NS62TR; Power: 50mW; Rated Temperature: 70°C; Temperature Coefficient: 200ppm/°C; Package Height: 0.23mm; Package Length: 0.6mm; Package Width: 0.3mm; Reference Standard: AEC-Q200; Category: Chip SMD Resistors; Manufacturer Part Number: CRCW02012K00FNED; RoHS: Yes; Stock: 14472; Pricing: 1=0,1, 10=0,037, 50=0,0242, 100=0,0204, 500=0,01426, 1000=0,01241, 5000=0,00924 (USD); Mounting Technology: Surface Mount; Pins: 2; Package Shape: Rectangular; Case/Package: 0201; Terminal Finish: Nickel; Min Operating Temperature: -55°C; Max Operating Temperature: 155°C; JESD-609 Code: e3; Termination: Wraparound; Resistor Type: FIXED RESISTOR; Construction: Chip; Package Style: SMTMeter; Packaging: Tape and Reel; Technology: METAL GLAZE/THICK FILM; Working Voltage: 30V; Reach SVHC Compliant: Yes; RoHS Compliant: Yes; ComponentLink1URL: https://datasheet.ciiva.com:443/pdfs/VipMasterIC/IC/VISH/VISH-S-A0002932828/VISH-S-A0002932828-1.pdf?src-supplier=IHS+Markit; ComponentLink1Description: https://datasheet.ciiva.com:443/pdfs/VipMasterIC/IC/VISH/VISH-S-A0002932828/VISH-S-A0002932828-1.pdf?src-supplier=IHS+Markit; Supplier 1: Digikey; Supplier Part Number 1: 541-2.00KABCT-ND; ComponentLink2URL: https://datasheet.ciiva.com/7690/1719906-7690620.pdf?src-supplier=Element14; ComponentLink2Description: https://datasheet.ciiva.com/7690/1719906-7690620.pdf?src-supplier=Element14; ComponentLink3URL: https://datasheet.ciiva.com/7690/1719906-7690621.pdf?src-supplier=Element14; ComponentLink3Description: https://datasheet.ciiva.com/7690/1719906-7690621.pdf?src-supplier=Element14; ComponentLink4URL: https://datasheet.ciiva.com/9074/crcw0201e3-9074873.pdf?src-supplier=Avnet; ComponentLink4Description: https://datasheet.ciiva.com/9074/crcw0201e3-9074873.pdf?src-supplier=Avnet; ComponentLink5URL: https://datasheet.ciiva.com/22675/1700795-22675166.pdf?src-supplier=Element14; ComponentLink5Description: https://datasheet.ciiva.com/22675/1700795-22675166.pdf?src-supplier=Element14
R508 = CRCW0201150KFKED: 150 kOhms ±1% 0.05W, 1/20W Chip Resistor 0201 (0603 Metric) Thick Film; Manufacturer: Vishay Dale; Power: 50 mW; Rated Temperature: 70 °C; Temperature Coefficient: ±100ppm/°C; Supplier: Digikey; Supplier Part Number: 541-2943-2-ND; Manufacturer Part Number: CRCW0201150KFKED; RoHS: Yes; Category: Chip SMD Resistors; Stock: 109k; Pricing: *; Mounting Technology: Surface Mount; Pins: 2; Package Shape: Rectangular; Case/Package: 0201; Terminal Finish: *; Min Operating Temperature: -55°C; Max Operating Temperature: 155°C; JESD-609 Code: e3; Resistor Type: FIXED RESISTOR; Packaging: Tape and Reel; Tehnology: *; Termination: *; Working Voltage: *; Reach SVHC Compliant: Yes; Medical Grade MFR: *; Medical Grade MFR PN: *; RoHS Compliant: Yes; Supplier 1: Mouser; Supplier Part Number 1: 71-CRCW0201150KFKED
R509 = CRCW02012M40FNED: Fixed Resistor, Metal Glaze/thick Film, 0.05W, 2400000ohm, 30V, 1% +/-Tol, 200ppm/Cel, Surface Mount, 0201; Manufacturer: Vishay Draloric; Medical Grade MFR: TBD; Power: 50mW; Rated Temperature: 70°C; Temperature Coefficient: 200ppm/°C; Category: Chip SMD Resistors; Supplier: Digikey; Supplier Part Number: 541-CRCW02011M80FNEDCT-ND; Manufacturer Part Number: CRCW02012M40FNED; RoHS: Yes; Stock: 32348; Pricing: 1=0,1, 10=0,037, 50=0,0242, 100=0,0204, 500=0,01426, 1000=0,01241, 5000=0,00924 (USD); Mounting Technology: Surface Mount; Pins: 2; Package Shape: Rectangular; Case/Package: 0201; Terminal Finish: Nickel; Min Operating Temperature: -55°C; Max Operating Temperature: 155°C; JESD-609 Code: e3; Resistor Type: FIXED RESISTOR; Packaging: Tape and Reel; Technology: METAL GLAZE/THICK FILM; Termination: Wraparound; Working Voltage: 30V; Reach SVHC Compliant: Yes; RoHS Compliant: Yes; ComponentLink1URL: https://datasheet.ciiva.com:443/pdfs/VipMasterIC/IC/VISH/VISH-S-A0002932828/VISH-S-A0002932828-1.pdf?src-supplier=IHS+Markit; ComponentLink1Description: https://datasheet.ciiva.com:443/pdfs/VipMasterIC/IC/VISH/VISH-S-A0002932828/VISH-S-A0002932828-1.pdf?src-supplier=IHS+Markit; ComponentLink2URL: https://datasheet.ciiva.com/7800/1719906-7800925.pdf?src-supplier=Element14; ComponentLink2Description: https://datasheet.ciiva.com/7800/1719906-7800925.pdf?src-supplier=Element14; ComponentLink3URL: https://datasheet.ciiva.com/7800/1719906-7800926.pdf?src-supplier=Element14; ComponentLink3Description: https://datasheet.ciiva.com/7800/1719906-7800926.pdf?src-supplier=Element14; ComponentLink4URL: https://datasheet.ciiva.com/22675/1700795-22675997.pdf?src-supplier=Element14; ComponentLink4Description: https://datasheet.ciiva.com/22675/1700795-22675997.pdf?src-supplier=Element14; ComponentLink5URL: https://datasheet.ciiva.com/22692/1719906-22692765.pdf?src-supplier=Element14; ComponentLink5Description: https://datasheet.ciiva.com/22692/1719906-22692765.pdf?src-supplier=Element14; Medical Grade MFR PN: TBD; Supplier 1: Digikey; Supplier Part Number 1: 541-CRCW02012M40FNEDCT-ND
R510 R511 = CRCW02011M60FNED: Fixed Resistor, Metal Glaze/thick Film, 0.05W, 1600000ohm, 30V, 1% +/-Tol, 200ppm/Cel, Surface Mount, 0201; Manufacturer: Vishay Dale; Medical Grade MFR: TBD; Power: 50mW; Rated Temperature: 70°C; Temperature Coefficient: 200ppm/°C; Category: Chip SMD Resistors; Manufacturer Part Number: CRCW02011M60FNED; RoHS: Yes; Stock: 32348; Pricing: 1=0,1, 10=0,037, 50=0,0242, 100=0,0204, 500=0,01426, 1000=0,01241, 5000=0,00924 (USD); Mounting Technology: Surface Mount; Pins: 2; Package Shape: Rectangular; Case/Package: 0201; Terminal Finish: Nickel; Min Operating Temperature: -55°C; Max Operating Temperature: 155°C; JESD-609 Code: e3; Resistor Type: FIXED RESISTOR; Packaging: Tape and Reel; Technology: METAL GLAZE/THICK FILM; Termination: Wraparound; Working Voltage: 30V; Reach SVHC Compliant: Yes; RoHS Compliant: Yes; ComponentLink1URL: https://datasheet.ciiva.com:443/pdfs/VipMasterIC/IC/VISH/VISH-S-A0002932828/VISH-S-A0002932828-1.pdf?src-supplier=IHS+Markit; ComponentLink1Description: https://datasheet.ciiva.com:443/pdfs/VipMasterIC/IC/VISH/VISH-S-A0002932828/VISH-S-A0002932828-1.pdf?src-supplier=IHS+Markit; ComponentLink2URL: https://datasheet.ciiva.com/7800/1719906-7800925.pdf?src-supplier=Element14; ComponentLink2Description: https://datasheet.ciiva.com/7800/1719906-7800925.pdf?src-supplier=Element14; ComponentLink3URL: https://datasheet.ciiva.com/7800/1719906-7800926.pdf?src-supplier=Element14; ComponentLink3Description: https://datasheet.ciiva.com/7800/1719906-7800926.pdf?src-supplier=Element14; ComponentLink4URL: https://datasheet.ciiva.com/22675/1700795-22675997.pdf?src-supplier=Element14; ComponentLink4Description: https://datasheet.ciiva.com/22675/1700795-22675997.pdf?src-supplier=Element14; ComponentLink5URL: https://datasheet.ciiva.com/22692/1719906-22692765.pdf?src-supplier=Element14; ComponentLink5Description: https://datasheet.ciiva.com/22692/1719906-22692765.pdf?src-supplier=Element14; Medical Grade MFR PN: TBD; Supplier 1: Digikey; Supplier Part Number 1: 541-CRCW02011M60FNEDCT-ND
R512 = CRCW0201100KFNED: Fixed Resistor, Metal Glaze/thick Film, 0.05W, 100000ohm, 30V, 1% +/-Tol, 200ppm/Cel, Surface Mount, 0201; Manufacturer: Vishay; Medical Grade MFR: Mini-Systems; Medical Grade MFR PN: MWA96SM-1003F-NS62TR; Power: 50mW; Rated Temperature: 70°C; Temperature Coefficient: 200ppm/°C; Package Height: 0.23mm; Package Length: 0.6mm; Package Width: 0.3mm; Reference Standard: AEC-Q200; Category: Chip SMD Resistors; Supplier: Digikey; Supplier Part Number: 541-100KABCT-ND; Manufacturer Part Number: CRCW0201100KFNED; RoHS: Yes; Stock: 8252; Pricing: 1=0,1, 10=0,037, 50=0,0242, 100=0,0204, 500=0,01426, 1000=0,01241, 5000=0,00924 (USD); Mounting Technology: Surface Mount; Pins: 2; Package Shape: Rectangular; Case/Package: 0201; Terminal Finish: Nickel; Min Operating Temperature: -55°C; Max Operating Temperature: 155°C; JESD-609 Code: e3; Resistor Type: FIXED RESISTOR; Construction: Chip; Package Style: SMTMeter; Packaging: Tape and Reel; Technology: METAL GLAZE/THICK FILM; Termination: Wraparound; Working Voltage: 30V; Reach SVHC Compliant: Yes; RoHS Compliant: Yes; ComponentLink1URL: https://datasheet.ciiva.com:443/pdfs/VipMasterIC/IC/VISH/VISH-S-A0002932828/VISH-S-A0002932828-1.pdf?src-supplier=IHS+Markit; ComponentLink1Description: https://datasheet.ciiva.com:443/pdfs/VipMasterIC/IC/VISH/VISH-S-A0002932828/VISH-S-A0002932828-1.pdf?src-supplier=IHS+Markit; ComponentLink2URL: https://datasheet.ciiva.com/2474/crcw0201e3-2474797.pdf?src-supplier=Digikey; ComponentLink2Description: https://datasheet.ciiva.com/2474/crcw0201e3-2474797.pdf?src-supplier=Digikey; ComponentLink3URL: https://datasheet.ciiva.com/2474/crcw0201e3-2474798.pdf?src-supplier=Digikey; ComponentLink3Description: https://datasheet.ciiva.com/2474/crcw0201e3-2474798.pdf?src-supplier=Digikey; ComponentLink4URL: https://datasheet.ciiva.com/2474/crcw0201e3-2474799.pdf?src-supplier=Digikey; ComponentLink4Description: https://datasheet.ciiva.com/2474/crcw0201e3-2474799.pdf?src-supplier=Digikey; ComponentLink5URL: https://datasheet.ciiva.com/16436/dcrcwe3-16436220.pdf?src-supplier=Future+Electronics; ComponentLink5Description: https://datasheet.ciiva.com/16436/dcrcwe3-16436220.pdf?src-supplier=Future+Electronics; ComponentLink6URL: https://datasheet.ciiva.com/28634/1847332-28634462.pdf?src-supplier=Element14; ComponentLink6Description: https://datasheet.ciiva.com/28634/1847332-28634462.pdf?src-supplier=Element14; ComponentLink7URL: https://datasheet.ciiva.com/22665/1700795-22665689.pdf?src-supplier=Element14; ComponentLink7Description: https://datasheet.ciiva.com/22665/1700795-22665689.pdf?src-supplier=Element14; ComponentLink8URL: https://datasheet.ciiva.com/22870/70202042-22870476.pdf?src-supplier=Allied+Electronics; ComponentLink8Description: https://datasheet.ciiva.com/22870/70202042-22870476.pdf?src-supplier=Allied+Electronics; ComponentLink9URL: https://datasheet.ciiva.com/16777/70202042-16777655.pdf?src-supplier=Allied+Electronics; ComponentLink9Description: https://datasheet.ciiva.com/16777/70202042-16777655.pdf?src-supplier=Allied+Electronics; Supplier 1: Digikey; Supplier Part Number 1: 541-100KABCT-ND
R515 R517 R523 = CRCW020110M0FNED: Fixed Resistor, Metal Glaze/thick Film, 0.05W, 10000000ohm, 30V, 1% +/-Tol, 200ppm/Cel, Surface Mount, 0201; Manufacturer: Vishay Draloric; Medical Grade MFR: Mini-Systems; Medical Grade MFR PN: MWA96SM-1005F-NS62TR; Power: 50mW; Rated Temperature: 70°C; Temperature Coefficient: 200ppm/°C; Category: Chip SMD Resistors; Supplier: Mouser; Supplier Part Number: 71-CRCW020110M0FNED; Manufacturer Part Number: CRCW020110M0FNED; RoHS: Yes; Stock: 159754; Pricing: 1=0,1, 10=0,024, 50=0,024, 100=0,014, 1000=0,011, 10000=0,006 (USD); Mounting Technology: Surface Mount; Pins: 2; Package Shape: Rectangular; Case/Package: 0201; Terminal Finish: Nickel; Min Operating Temperature: -55°C; Max Operating Temperature: 155°C; JESD-609 Code: e3; Resistor Type: FIXED RESISTOR; Packaging: Tape and Reel; Technology: METAL GLAZE/THICK FILM; Termination: Wraparound; Working Voltage: 30V; Reach SVHC Compliant: Yes; RoHS Compliant: Yes; ComponentLink1URL: https://datasheet.ciiva.com:443/pdfs/VipMasterIC/IC/VISH/VISH-S-A0002932828/VISH-S-A0002932828-1.pdf?src-supplier=IHS+Markit; ComponentLink1Description: https://datasheet.ciiva.com:443/pdfs/VipMasterIC/IC/VISH/VISH-S-A0002932828/VISH-S-A0002932828-1.pdf?src-supplier=IHS+Markit; ComponentLink2URL: https://datasheet.ciiva.com/7673/1719906-7673177.pdf?src-supplier=Element14; ComponentLink2Description: https://datasheet.ciiva.com/7673/1719906-7673177.pdf?src-supplier=Element14; ComponentLink3URL: https://datasheet.ciiva.com/7673/1719906-7673178.pdf?src-supplier=Element14; ComponentLink3Description: https://datasheet.ciiva.com/7673/1719906-7673178.pdf?src-supplier=Element14; ComponentLink4URL: https://datasheet.ciiva.com/22692/1719906-22692711.pdf?src-supplier=Element14; ComponentLink4Description: https://datasheet.ciiva.com/22692/1719906-22692711.pdf?src-supplier=Element14; ComponentLink5URL: https://datasheet.ciiva.com/22665/1700795-22665701.pdf?src-supplier=Element14; ComponentLink5Description: https://datasheet.ciiva.com/22665/1700795-22665701.pdf?src-supplier=Element14; Supplier 1: Digikey; Supplier Part Number 1: 541-CRCW020110M0FNEDCT-ND
R516 R518 R520 = CRCW020149K9FNED: Fixed Resistor, Metal Glaze/thick Film, 0.05W, 49900ohm, 30V, 1% +/-Tol, 200ppm/Cel, Surface Mount, 0201; Manufacturer: Vishay; Medical Grade MFR: Mini-Systems; Medical Grade MFR PN: MWA96SM-4992F-NS62TR; Power: 50mW; Rated Temperature: 70°C; Temperature Coefficient: 200ppm/°C; Package Height: 0.23mm; Package Length: 0.6mm; Package Width: 0.3mm; Reference Standard: AEC-Q200; Supplier: Digikey; Supplier Part Number: 541-49.9KABCT-ND; Manufacturer Part Number: CRCW020149K9FNED; RoHS: Yes; Category: Chip SMD Resistors; Stock: 25072; Pricing: 1=0,1, 10=0,037, 50=0,0242, 100=0,0204, 500=0,01426, 1000=0,01241, 5000=0,00924 (USD); Mounting Technology: Surface Mount; Pins: 2; Package Shape: Rectangular; Case/Package: 0201; Terminal Finish: Nickel; Min Operating Temperature: -55°C; Max Operating Temperature: 155°C; JESD-609 Code: e3; Resistor Type: FIXED RESISTOR; Construction: Chip; Package Style: SMTMeter; Packaging: Tape and Reel; Technology: METAL GLAZE/THICK FILM; Termination: Wraparound; Working Voltage: 30V; Reach SVHC Compliant: Yes; RoHS Compliant: Yes; ComponentLink1URL: https://datasheet.ciiva.com:443/pdfs/VipMasterIC/IC/VISH/VISH-S-A0002932828/VISH-S-A0002932828-1.pdf?src-supplier=IHS+Markit; ComponentLink1Description: https://datasheet.ciiva.com:443/pdfs/VipMasterIC/IC/VISH/VISH-S-A0002932828/VISH-S-A0002932828-1.pdf?src-supplier=IHS+Markit; ComponentLink2URL: https://datasheet.ciiva.com/7673/1719906-7673210.pdf?src-supplier=Element14; ComponentLink2Description: https://datasheet.ciiva.com/7673/1719906-7673210.pdf?src-supplier=Element14; ComponentLink3URL: https://datasheet.ciiva.com/7673/1719906-7673209.pdf?src-supplier=Element14; ComponentLink3Description: https://datasheet.ciiva.com/7673/1719906-7673209.pdf?src-supplier=Element14; ComponentLink4URL: https://datasheet.ciiva.com/22643/1635184-22643438.pdf?src-supplier=Element14; ComponentLink4Description: https://datasheet.ciiva.com/22643/1635184-22643438.pdf?src-supplier=Element14; ComponentLink5URL: https://datasheet.ciiva.com/7172/1635184-7172907.pdf?src-supplier=Newark; ComponentLink5Description: https://datasheet.ciiva.com/7172/1635184-7172907.pdf?src-supplier=Newark; ComponentLink6URL: https://datasheet.ciiva.com/16208/dcrcwe3-16208758.pdf?src-supplier=Future+Electronics; ComponentLink6Description: https://datasheet.ciiva.com/16208/dcrcwe3-16208758.pdf?src-supplier=Future+Electronics; Supplier 1: Digikey; Supplier Part Number 1: 541-49.9KABCT-ND
R519 R521 = CRCW02010000Z0ED: Fixed Resistor, Metal Glaze/thick Film, 0.05W, 0ohm, Surface Mount, 0201; Manufacturer: Vishay; Medical Grade MFR: Mini-Systems; Medical Grade MFR PN: MWA96SM-0000F-NS62TR; Power: 50mW; Rated Temperature: 70°C; Package Height: 0.23mm; Package Length: 0.6mm; Package Width: 0.3mm; Reference Standard: AEC-Q200; Category: Chip SMD Resistors; Supplier: Digikey; Supplier Part Number: 541-0.0AGCT-ND; Manufacturer Part Number: CRCW02010000Z0ED; RoHS: Yes; Stock: 701366; Pricing: 1=0,1, 10=0,034, 25=0,026, 50=0,0198, 100=0,0138, 250=0,01112, 500=0,0089, 1000=0,00655, 5000=0,0047 (USD); Mounting Technology: Surface Mount; Pins: 2; Package Shape: Rectangular; Case/Package: 0201; Terminal Finish: Nickel; Min Operating Temperature: -55°C; Max Operating Temperature: 155°C; JESD-609 Code: e3; Resistor Type: FIXED RESISTOR; Construction: Chip; Package Style: SMTMeter; Packaging: Tape and Reel; Technology: METAL GLAZE/THICK FILM; Termination: Wraparound; Reach SVHC Compliant: Yes; RoHS Compliant: Yes; ComponentLink1URL: https://datasheet.ciiva.com:443/pdfs/VipMasterIC/IC/VISH/VISH-S-A0002932828/VISH-S-A0002932828-1.pdf?src-supplier=IHS+Markit; ComponentLink1Description: https://datasheet.ciiva.com:443/pdfs/VipMasterIC/IC/VISH/VISH-S-A0002932828/VISH-S-A0002932828-1.pdf?src-supplier=IHS+Markit; ComponentLink2URL: https://datasheet.ciiva.com/2471/crcw0201e3-2471712.pdf?src-supplier=Digikey; ComponentLink2Description: https://datasheet.ciiva.com/2471/crcw0201e3-2471712.pdf?src-supplier=Digikey; ComponentLink3URL: https://datasheet.ciiva.com/7841/1719906-7841431.pdf?src-supplier=Element14; ComponentLink3Description: https://datasheet.ciiva.com/7841/1719906-7841431.pdf?src-supplier=Element14; ComponentLink4URL: https://datasheet.ciiva.com/7841/1719906-7841430.pdf?src-supplier=Element14; ComponentLink4Description: https://datasheet.ciiva.com/7841/1719906-7841430.pdf?src-supplier=Element14; ComponentLink5URL: https://datasheet.ciiva.com/22665/1847332-22665688.pdf?src-supplier=Element14; ComponentLink5Description: https://datasheet.ciiva.com/22665/1847332-22665688.pdf?src-supplier=Element14; ComponentLink6URL: https://datasheet.ciiva.com/2471/crcw0201e3-2471713.pdf?src-supplier=Digikey; ComponentLink6Description: https://datasheet.ciiva.com/2471/crcw0201e3-2471713.pdf?src-supplier=Digikey; ComponentLink7URL: https://datasheet.ciiva.com/2471/crcw0201e3-2471711.pdf?src-supplier=Digikey; ComponentLink7Description: https://datasheet.ciiva.com/2471/crcw0201e3-2471711.pdf?src-supplier=Digikey; ComponentLink8URL: https://datasheet.ciiva.com/16757/70202042-16757849.pdf?src-supplier=Allied+Electronics; ComponentLink8Description: https://datasheet.ciiva.com/16757/70202042-16757849.pdf?src-supplier=Allied+Electronics; ComponentLink9URL: https://datasheet.ciiva.com/16436/crcw0201e3-16436237.pdf?src-supplier=Future+Electronics; ComponentLink9Description: https://datasheet.ciiva.com/16436/crcw0201e3-16436237.pdf?src-supplier=Future+Electronics; Supplier 1: Digikey; Supplier Part Number 1: 541-0.0AGDKR-ND
R524 = CRCW02016M80FNED: Fixed Resistor, Metal Glaze/thick Film, 0.05W, 6800000ohm, 30V, 1% +/-Tol, 200ppm/Cel, Surface Mount, 0201; Manufacturer: Vishay Draloric; Medical Grade MFR: TBD; Power: 50mW; Rated Temperature: 70°C; Temperature Coefficient: 200ppm/°C; Category: Chip SMD Resistors; Supplier: Digikey; Supplier Part Number: 541-CRCW02016M80FNEDCT-ND; Manufacturer Part Number: CRCW02016M80FNED; RoHS: Yes; Stock: 8955; Pricing: 1=0,1, 10=0,037, 50=0,0242, 100=0,0204, 500=0,01426, 1000=0,01241, 5000=0,00924 (USD); Mounting Technology: Surface Mount; Pins: 2; Package Shape: Rectangular; Case/Package: 0201; Terminal Finish: Nickel; Min Operating Temperature: -55°C; Max Operating Temperature: 155°C; JESD-609 Code: e3; Resistor Type: FIXED RESISTOR; Packaging: Tape and Reel; Technology: METAL GLAZE/THICK FILM; Termination: Wraparound; Working Voltage: 30V; Reach SVHC Compliant: Yes; RoHS Compliant: Yes; ComponentLink1URL: https://datasheet.ciiva.com:443/pdfs/VipMasterIC/IC/VISH/VISH-S-A0002932828/VISH-S-A0002932828-1.pdf?src-supplier=IHS+Markit; ComponentLink1Description: https://datasheet.ciiva.com:443/pdfs/VipMasterIC/IC/VISH/VISH-S-A0002932828/VISH-S-A0002932828-1.pdf?src-supplier=IHS+Markit; ComponentLink2URL: https://datasheet.ciiva.com/22682/1700795-22682637.pdf?src-supplier=Element14; ComponentLink2Description: https://datasheet.ciiva.com/22682/1700795-22682637.pdf?src-supplier=Element14; Medical Grade MFR PN: TBD; Supplier 1: Digikey; Supplier Part Number 1: 541-CRCW02016M80FNEDCT-ND
TP500-TP515 = Test Point: Test pad, 0.90mm circular pad; PCB Footprint: testpad_0p90mm; Length (mm): 0.90; Manufacturer: N/A; Manufacturer PN: N/A; Medical Grade MFR: N/A; Medical Grade MFR PN: N/A; Rating: N/A; Thickness (mm): N/A; Value: Test point; Width (mm): 0.90; Category: Test point; Status: *; Review: *
U500 U501 U503 U504 = AD8505ACBZ-R7: Op Amp, Rail-to-Rail, 95kHz, WLCSP-6; Medical Grade MFR: TBD; Rating: 5.5V; Category: IC; Length (mm): 1.39 ±0.04; Medical Grade MFR PN: TBD; PCB Footprint: TBD; Thickness (mm): 0.56 ±0.05; Width (mm): 0.90 ±0.04; Package Description: TBD; Supplier 1: Digi-Key; Supplier Part Number 1: AD8505ACBZ-R7CT-ND; Status: *; Review: *; Manufacturer Part Number: AD8505ACBZ-R7; Value: AD8505ACBZ-R7
U502 = LTC3130IUDC-1#PBF: Buck-Boost Converter, Selectable Voltage, QFN-20; Medical Grade MFR: TBD; Rating: 25V; Category: IC; Length (mm): 4.00 ±0.10; Medical Grade MFR PN: TBD; PackageDescription: TBD; PCB Footprint: TBD; Thickness (mm): 0.75 ±0.05; Value: LTC3130IUDC-1#PBF; Width (mm): 3.00 ±0.10; Supplier 1: Digi-Key; Supplier Part Number 1: LTC3130IUDC-1#PBF-ND; Status: *; Review: *; Manufacturer Part Number: LTC3130IUDC-1#PBF
U505 U507 = DMC31D5UDJ-7: MOSFET N/P-CH 30V 0.22A SOT963; Manufacturer: Diodes inc.; Number of Channels: 2; Power Dissipation: 350mW; Id(Max): -200mA; Vgs(Max): ±12V; Vth(Max): -1.0V; Ron(Max): 4.5Ohm; Cin: 22.6pF; Manufacturer Part Number: DMC31D5UDJ-7; Category: Transistors; Type: MOSFET array; RoHs: RoHS 2; Package: SOT-963; Supplier 1: Digikey; Supplier Part Number 1: DMC31D5UDJ-7DICT-ND
U506 U508 = DMN31D5UDJ-7: MOSFET 2N-CH 30V 0.22A SOT963; Manufacturer: Diodes inc.; Number of Channels: 2; Power Dissipation: 350mW; Id(Max): 220mA; Vgs(Max): ±12V; Vth(Max): 1.0V; Ron(Max): 4.5Ohm; Cin: 22.6pF; Manufacturer Part Number: DMN31D5UDJ-7; Category: Transistors; Type: MOSFET array; RoHs: RoHS 2; Package: SOT-963; Supplier 1: Digikey; Supplier Part Number 1: 31-DMN31D5UDJ-7CT-ND